# Altium project LAN7800_USB_Ethernet_RevA.PrjPcb
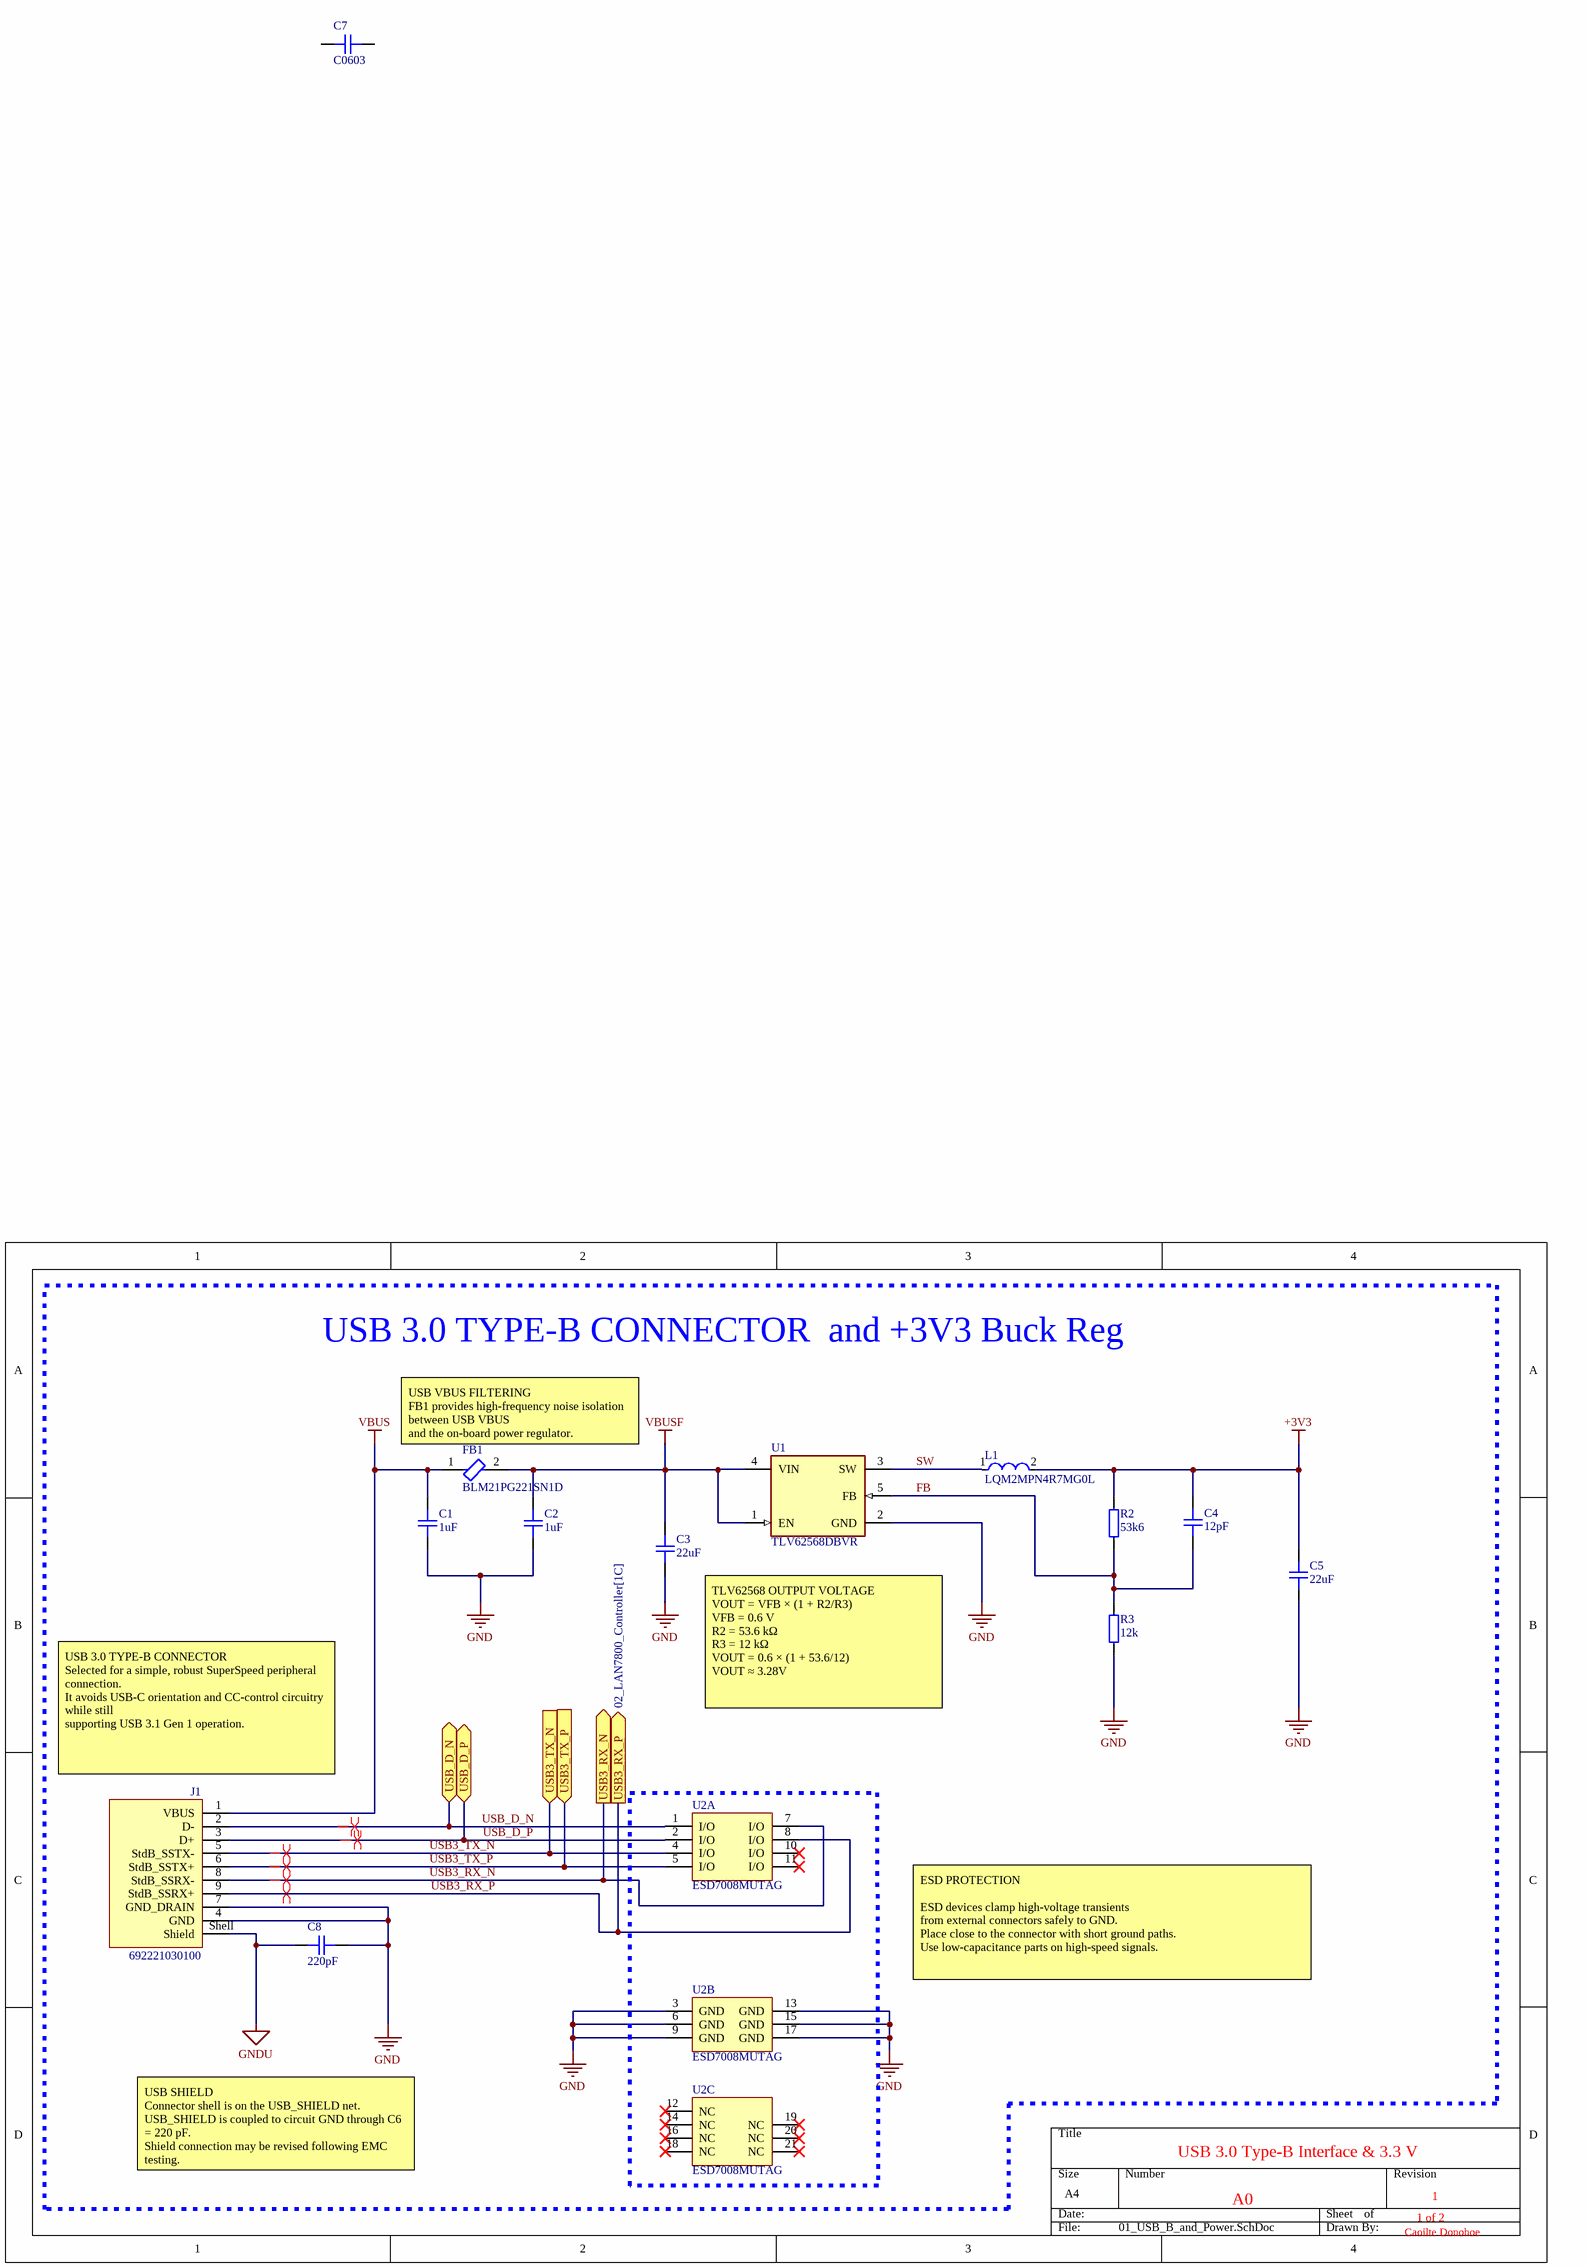
[diagram p0: 01_USB_B_and_Power.SchDoc]
2 sheets, 48 parts. Net scope: flat (ports and power ports of the same name join across sheets).
Board file: LAN7800_USB_Ethernet_RevA.PcbDoc
Sheets:
  01_USB_B_and_Power.SchDoc
  02_LAN7800_Controller.SchDoc

## Sheet 01_USB_B_and_Power.SchDoc: USB 3.0 Type-B Interface & 3.3 V Power
size A4; DrawnBy: Caoilte Donohoe; Revision: A0; SheetNumber: 1; SheetTotal: 4; Project Name: USB3 Gigabit Ethernet Adapter

### Parts
C1  1uF  [CAP_0402]
C2  1uF  [CAP_0402]
C3  22uF  [CAP_0805]
C4  12pF  [CAP_0402]
C5  22uF  [CAP_0805]
C6  22pF  [CAP_0603]
C7  C0603  [CAP_0603]
C8  220pF  [CAP_0603]
FB1  BLM21PG221SN1D  [FP-BLM21-0_2-t0_85-e0_5-IPC_C]
J1  692221030100  [692221030100]
L1  LQM2MPN4R7MG0L  [FP-LQM2MPN_G0-IPC_B]
R2  53k6  [RES_0402]
R3  12k  [RES_0402]
U1  TLV62568DBVR  [FP-DBV0005A-MFG]
U2  ESD7008MUTAG  [ONSC-UDFN-18-517BV_V]  (parts A,B,C of 3)

### Ports
USB3_RX_N (out, see 02_LAN7800_Controller[1C]), USB3_RX_P (out, see 02_LAN7800_Controller[1C]), USB3_TX_N (in), USB3_TX_P (in), USB_D_N (bidir, see 02_LAN7800_Controller[1C]), USB_D_P (bidir, see 02_LAN7800_Controller[1C])

### Nets
+3V3: C4.2 C5.2 L1.2 R2.2
GND: C1.1 C2.1 C3.1 C5.1 C8.2 J1.4(GND) J1.7(GND_DRAIN) R3.1 U1.2(GND) U2.3(GND) U2.6(GND) U2.9(GND) U2.13(GND) U2.15(GND) U2.17(GND)
GNDU: C8.1 J1.Shell(Shield)
VBUS: C1.2 FB1.1 J1.1(VBUS)
VBUSF: C2.2 C3.2 FB1.2 U1.1(EN) U1.4(VIN)
FB: C4.1 R2.1 R3.2 U1.5(FB)
SW: L1.1 U1.3(SW)
USB3_RX_N: J1.8(StdB_SSRX-) U2.7(I/O) ; port USB3_RX_N
USB3_RX_P: J1.9(StdB_SSRX+) U2.8(I/O) ; port USB3_RX_P
USB3_TX_N: J1.5(StdB_SSTX-) U2.4(I/O) ; port USB3_TX_N
USB3_TX_P: J1.6(StdB_SSTX+) U2.5(I/O) ; port USB3_TX_P
USB_D_N: J1.2(D-) U2.1(I/O) ; port USB_D_N
USB_D_P: J1.3(D+) U2.2(I/O) ; port USB_D_P

Not connected (* = marked no-connect by the designer): C6 1 2; C7 1 2; U2 10(I/O)* 11(I/O)* 12(NC)* 14(NC)* 16(NC)* 18(NC)* 19(NC)* 20(NC)* 21(NC)*

### Layout directives
differential pair: USB3_RX_N, USB3_RX_P, USB3_TX_N, USB3_TX_P, USB_D_N, USB_D_P

### Notes on the sheet
- USB 3.0 TYPE-B CONNECTOR  and +3V3 Buck Reg
- (near FB1) USB VBUS FILTERING
  FB1 provides high-frequency noise isolation between USB VBUS
  and the on-board power regulator.
- TLV62568 OUTPUT VOLTAGE
  VOUT = VFB × (1 + R2/R3)
  VFB = 0.6 V
  R2 = 53.6 kΩ
  R3 = 12 kΩ
  VOUT = 0.6 × (1 + 53.6/12)
  VOUT ≈ 3.28V
- (near J1) USB 3.0 TYPE-B CONNECTOR
  Selected for a simple, robust SuperSpeed peripheral connection.
  It avoids USB-C orientation and CC-control circuitry while still
  supporting USB 3.1 Gen 1 operation.
- ESD PROTECTION
  ESD devices clamp high-voltage transients
  from external connectors safely to GND.
  Place close to the connector with short ground paths.
  Use low-capacitance parts on high-speed signals.
- USB 3.0 Type-B Interface & 3.3 V Power
- USB SHIELD
  Connector shell is on the USB_SHIELD net.
  USB_SHIELD is coupled to circuit GND through C6 = 220 pF.
  Shield connection may be revised following EMC testing.
- A0
- 1 of 2
- 1
- Caoilte Donohoe

### Library data of the parts
C1 C2 C4 = CAP_0402: Capacitor SMD 0402; Manufacturer: *; Manufacturer Part Number: *; Distributor Link: *; LCSC: *; Rating: *; Dielectric: *
C3 C5 = CAP_0805: Capacitor SMD 0805; Manufacturer: *; Manufacturer Part Number: *; Distributor Link: *; LCSC: *; Rating: *; Dielectric: *
C6-C8 = CAP_0603: Capacitor SMD 0603; Manufacturer: *; Manufacturer Part Number: *; Distributor Link: *; LCSC: *; Rating: *; Dielectric: *
FB1 = CMP-0686-00610-3: Chip Ferrite Bead, 0805, 220Ω @ 100MHz, 0.045Ω, 25%, 2A; Number of Circuits: 1; Shielding: Unshielded; DC Resistance (DCR): 45mR; Impedance: 220R; Radiation Hardening: No; Material: Ferrite; Frequency: 100MHz; Width: 1.25mm; DC Current: 2A; Max DC Current: 2A; Number of Lines: 1; Package Quantity: 1; Case Code (Metric): 2012; Current Rating: 2A; Case/Package: 0805; Current: 2A; Military Standard: Not; Core Material: Ferrite; Depth: 1.25mm; Contact Plating: Tin; DC Resistance-Max: 45mR; Max Operating Temperature: 125°C; Length: 2mm; Max Current Rating: 2A; REACH SVHC: No SVHC; Termination: SMD/SMT; Min Operating Temperature: -55°C; Series: BLM21P; Test Frequency: 100MHz; Tolerance: 25%; Number of Pins: 2; RoHS Compliant: Yes; Height: 0.85mm; Packaging: Tape and Reel; Lead Free: Lead Free; Case Code (Imperial): 0805
J1 = CMP-1502-03224-3: Conn USB 3.0 Type B RCP 9 POS (1.75mm/2.5)mm/1.25mm Solder RA Thru-Hole 9 Terminal 1 Port Tray; Gender: Receptacle; USB Standard: USB 3.0; Insulation Resistance: 100MΩ; Voltage Rating: 30V; Current Rating: 250mA; Number of Contacts: 9; Contact Resistance: 50mΩ; Number of Ports: 1; Max Operating Temperature: 85°C; Contact Plating: Gold; Termination: Through Hole; Orientation: Horizontal; Contact Material: Nickel, Tin; RoHS: Compliant; Min Operating Temperature: -20°C; Flammability Rating: UL94 V-0; Connector Type: USB; Height: 13.05mm; Features: Shielded; Number of Pins: 9; Operating Supply Voltage: 30V; Mount: Horizontal, PCB, Through Hole; Lead Free: Lead Free; Voltage Rating (AC): 30V; Length: 12mm; Width: 18.3mm; Color: Blue
L1 = CMP-06042-016483-1: Multilayer Type Inductor for Power Lines, 0806 (2016), 4.7μH, 20%, 0.175Ω, 1.1A; Self Resonant Frequency: 20MHz; DC Resistance (DCR): 175mR; Test Frequency: 1MHz; Core Material: Ferrite; Shielding: Shielded; Inductance: 4.7uH; Max DC Current: 1.1A; Case Code (Metric): 2016; Min Operating Temperature: -55°C; Military Standard: Not; Depth: 1.75mm; RoHS Compliant: Yes; Packaging: Tape and Reel; Termination: SMD/SMT; Max Operating Temperature: 125°C; Case Code (Imperial): 0806; Width: 0.049inch; Package Quantity: 3000; Length: 0.079inch; DC Current: 1.1A; Mount: Surface Mount; Current Rating: 1.1A; Height - Seated (Max): 0.039inch; Case/Package: 0805; Weight: 0.000353oz; Height: 0.9mm; Tolerance: 20%
R2 R3 = RES_0402: Resistor SMD 0402; Manufacturer: *; Manufacturer Part Number: *; Distributor Link: *; LCSC: *
U1 = CMP-04918-000009-1: IC REG BUCK ADJ 1A SOT23-5; Manufacturer: Texas Instruments; Number Of Outputs: 1; Max Supply Voltage: 5.5V; Nominal Supply Current: 35uA; Standoff Height: 0mm; Max Junction Temp: +125°C; Output Voltage: 0.6-5.5V; Max Duty Cycle: 100%; Output Type: AdjustableProgrammable; Min Supply Voltage: 2.5V; Switching Frequency: 1.5MHz; Height: 1.45mm; Mouser Description: 1-A High Efficiency Synchronous Buck Converter, SMD, 5-pin SOT-23, T/R 3k; Temperature Range High: +125°C; Manufacturer Part Number: TLV62568DBVR; Switching Topology: Buck; ComponentLink2Description: Datasheet; Digikey Description: IC REG BUCK ADJ 1A SOT23-5; Octopart: https://octopart.com/tlv62568dbvr-texas+instruments-76926199; Category: IC; Device Class L1: Integrated Circuits (ICs); RoHS: TRUE; ComponentLink2URL: http://www.ti.com/lit/ds/symlink/tlv62568.pdf; Lead Free: Yes; Package: DBV0005A; Automotive: No; Device Class L2: Power Management ICs; Temperature: -40°C to +125°C; Temperature Range Low: -40°C; Device Class L3: Voltage Regulators - Switching; Output Current: 1A
U2 = CMP-1063-00247-1: Transient Voltage Suppressor, Low Capacitance ESD Protection for High Speed Data, 18-Pin UDFN, Pb-Free, Tape and Reel; Manufacturer: On Semiconductor; VRWM Max (V): 5; V(BR) Min (V): 5.5; Direction: Bidirectional; Number of Lines: 8; IR Max (uA): 1; ComponentLink1Description: Manufacturer URL; PackageReference: UDFN-18-517BV; PackageDescription: 18-Pin Small Outline No-Lead, Body 5.5 x 1.5 mm; PartNumber: ESD7008MUTAG; ComponentLink3URL: http://www.onsemi.cn/pub_link/Collateral/517BV.PDF; PackageVersion: Rev. A, 12/2012; ComponentLink2URL: http://www.onsemi.cn/pub_link/Collateral/ESD7008-D.PDF; DatasheetVersion: Rev. 4; ComponentLink2Description: Datasheet; RoHS: Pb-Free; Packing: Tape and Reel; Mounting Technology: Surface Mount; ComponentLink1URL: http://www.onsemi.com/; ComponentLink3Description: Package Specification

## Sheet 02_LAN7800_Controller.SchDoc
size A4; SheetNumber: 2; SheetTotal: 2
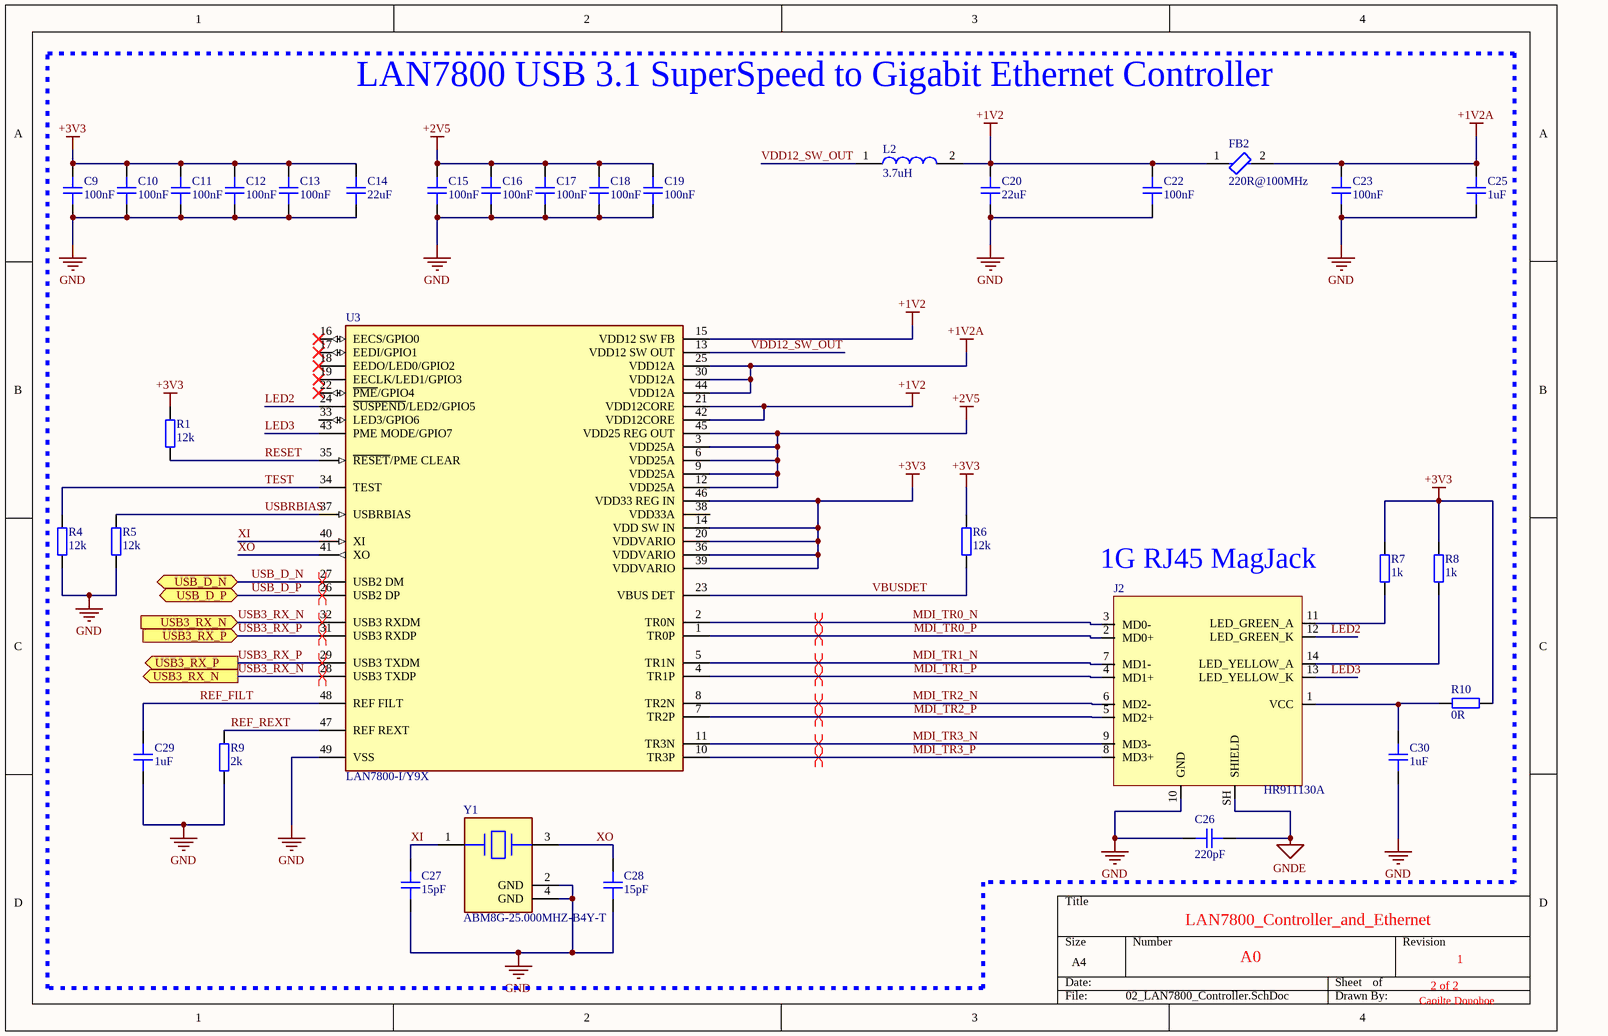
[diagram p1: 02_LAN7800_Controller.SchDoc]

### Parts
C9  100nF  [CAP_0402]
C10  100nF  [CAP_0402]
C11  100nF  [CAP_0402]
C12  100nF  [CAP_0402]
C13  100nF  [CAP_0402]
C14  22uF  [CAP_0603]
C15  100nF  [CAP_0402]
C16  100nF  [CAP_0402]
C17  100nF  [CAP_0402]
C18  100nF  [CAP_0402]
C19  100nF  [CAP_0402]
C20  22uF  [CAP_0603]
C22  100nF  [CAP_0402]
C23  100nF  [CAP_0402]
C25  1uF  [CAP_0402]
C26  220pF  [CAP_0603]
C27  15pF  [CAP_0603]
C28  15pF  [CAP_0603]
C29  1uF  [CAP_0402]
C30  1uF  [CAP_0402]
FB2  220R@100MHz  [FP-BLM21-0_2-t0_85-e0_5-IPC_C]
J2  HR911130A  [HR911130A]
L2  3.7uH  [LQM18PH1R0MFRB]
R1  12k  [RES_0402]
R4  12k  [RES_0402]
R5  12k  [RES_0402]
R6  12k  [RES_0402]
R7  1k  [RES_0402]
R8  1k  [RES_0402]
R9  2k  [RES_0402]
R10  0R  [RES_0402]
U3  LAN7800-I/Y9X  [FP-48SQFN-5304-7x7B-IPC_B]
Y1  ABM8G-25.000MHZ-B4Y-T  [FP-ABM8G-MFG]

### Ports
USB3_RX_N (in, see 01_USB_B_and_Power[2C], 02_LAN7800_Controller[1C]), USB3_RX_N (out, see 01_USB_B_and_Power[2C], 02_LAN7800_Controller[1C]), USB3_RX_P (in, see 01_USB_B_and_Power[2C], 02_LAN7800_Controller[1C]), USB3_RX_P (out, see 01_USB_B_and_Power[2C], 02_LAN7800_Controller[1C]), USB_D_N (bidir, see 01_USB_B_and_Power[2C]), USB_D_P (bidir, see 01_USB_B_and_Power[2C])

### Nets
+1V2: C20.2 C22.2 FB2.1 L2.2 U3.15(VDD12_SW_FB) U3.21(VDD12CORE) U3.42(VDD12CORE)
+1V2A: C23.2 C25.2 FB2.2 U3.25(VDD12A) U3.30(VDD12A) U3.44(VDD12A)
+2V5: C15.2 C16.2 C17.2 C18.2 C19.2 U3.3(VDD25A) U3.6(VDD25A) U3.9(VDD25A) U3.12(VDD25A) U3.45(VDD25_REG_OUT)
+3V3: C9.2 C10.2 C11.2 C12.2 C13.2 C14.2 R1.2 R6.1 R7.1 R8.1 R10.2 U3.14(VDD_SW_IN) U3.20(VDDVARIO) U3.36(VDDVARIO) U3.39(VDDVARIO) U3.46(VDD33_REG_IN)
GND: C9.1 C10.1 C11.1 C12.1 C13.1 C14.1 C15.1 C16.1 C17.1 C18.1 C19.1 C20.1 C22.1 C23.1 C25.1 C26.1 C27.1 C28.1 C29.1 C30.1 J2.10(GND) R4.1 R5.1 R9.1 U3.49(VSS) Y1.2(GND) Y1.4(GND)
GNDE: C26.2 J2.SH(SHIELD)
LED2: J2.12(LED_GREEN_K) U3.24(~{SUSPEND}/LED2/GPIO5)
LED3: J2.13(LED_YELLOW_K) U3.43(PME_MODE/GPIO7)
MDI_TR0_N: J2.3(MD0-) U3.2(TR0N)
MDI_TR0_P: J2.2(MD0+) U3.1(TR0P)
MDI_TR1_N: J2.7(MD1-) U3.5(TR1N)
MDI_TR1_P: J2.4(MD1+) U3.4(TR1P)
MDI_TR2_N: J2.6(MD2-) U3.8(TR2N)
MDI_TR2_P: J2.5(MD2+) U3.7(TR2P)
MDI_TR3_N: J2.9(MD3-) U3.11(TR3N)
MDI_TR3_P: J2.8(MD3+) U3.10(TR3P)
REF_FILT: C29.2 U3.48(REF_FILT)
REF_REXT: R9.2 U3.47(REF_REXT)
RESET: R1.1 U3.35(~{RESET}/PME_CLEAR)
TEST: R4.2 U3.34(TEST)
USB3_RX_N: U3.28(USB3_TXDP) U3.32(USB3_RXDM) ; port USB3_RX_N
USB3_RX_P: U3.29(USB3_TXDM) U3.31(USB3_RXDP) ; port USB3_RX_P
USB_D_N: U3.27(USB2_DM) ; port USB_D_N
USB_D_P: U3.26(USB2_DP) ; port USB_D_P
USBRBIAS: R5.2 U3.37(USBRBIAS)
VBUSDET: R6.2 U3.23(VBUS_DET)
VDD12_SW_OUT: L2.1 U3.13(VDD12_SW_OUT)
XI: C27.2 U3.40(XI) Y1.1
XO: C28.2 U3.41(XO) Y1.3
NetC30_2: C30.2 J2.1(VCC) R10.1
NetJ2_11: J2.11(LED_GREEN_A) R7.2
NetJ2_14: J2.14(LED_YELLOW_A) R8.2

Not connected (* = marked no-connect by the designer): U3 16(EECS/GPIO0)* 17(EEDI/GPIO1)* 18(EEDO/LED0/GPIO2)* 19(EECLK/LED1/GPIO3)* 22(~{PME}/GPIO4)* 33(LED3/GPIO6) 38(VDD33A)

### Layout directives
differential pair: MDI_TR0_N, MDI_TR0_P, MDI_TR1_N, MDI_TR1_P, MDI_TR2_N, MDI_TR2_P, MDI_TR3_N, MDI_TR3_P, USB3_RX_N, USB3_RX_P, USB_D_N, USB_D_P

### Notes on the sheet
- LAN7800 USB 3.1 SuperSpeed to Gigabit Ethernet Controller
- 1G RJ45 MagJack
- LAN7800_Controller_and_Ethernet
- A0
- 2 of 2
- 1
- Caoilte Donohoe

### Library data of the parts
C9-C13 C15-C19 C22 C23 C25 C29 C30 = CAP_0402: Capacitor SMD 0402; Manufacturer: *; Manufacturer Part Number: *; Distributor Link: *; LCSC: *; Rating: *; Dielectric: *
C14 C20 C26-C28 = CAP_0603: Capacitor SMD 0603; Manufacturer: *; Manufacturer Part Number: *; Distributor Link: *; LCSC: *; Rating: *; Dielectric: *
FB2 = CMP-0686-00610-3: as FB1 on sheet 01_USB_B_and_Power; Radiation Hardening: No; Material: Ferrite; Frequency: 100MHz; Width: 1.25mm; DC Current: 2A; Max DC Current: 2A; Number of Lines: 1; Package Quantity: 1; Case Code (Metric): 2012; Current Rating: 2A; Case/Package: 0805; Current: 2A; Military Standard: Not; Core Material: Ferrite; Depth: 1.25mm; Contact Plating: Tin; DC Resistance-Max: 45mR; Max Operating Temperature: 125°C; Length: 2mm; Max Current Rating: 2A; REACH SVHC: No SVHC; Termination: SMD/SMT; Min Operating Temperature: -55°C; Series: BLM21P; Test Frequency: 100MHz; Tolerance: 25%; Number of Pins: 2; RoHS Compliant: Yes; Height: 0.85mm; Packaging: Tape and Reel; Lead Free: Lead Free; Case Code (Imperial): 0805
J2 = HR911130A: 100/1000Base-T Magnetics Single-Port RJ45 Connector with Integrated Magnetics and LEDs; Manufacturer: Hanrun; Manufacturer Part Number: HR911130A
L2 = LQM18PN3R3MFRL: Inductor; Manufacturer_Name: Murata Electronics; Datasheet Link: https://search.murata.co.jp/Ceramy/image/img/P02/JELF243B-0033.pdf; Height: 0.95mm; Manufacturer_Part_Number: LQM18PN3R3MFRL; Mouser Part Number: 81-LQM18PN3R3MFRL; Mouser Price/Stock: https://www.mouser.co.uk/ProductDetail/Murata-Electronics/LQM18PN3R3MFRL?qs=Gufeu08L%2Fl3lDzOKkPPhgg%3D%3D; Arrow Part Number: LQM18PN3R3MFRL; Arrow Price/Stock: https://www.arrow.com/en/products/lqm18pn3r3mfrl/murata-manufacturing
R1 R4-R10 = RES_0402: Resistor SMD 0402; Manufacturer: *; Manufacturer Part Number: *; Distributor Link: *; LCSC: *
U3 = CMP-06298-000014-1: IC ETHERNET CTLR USB 48SQFN; Operating Supply Current: 4mA; Min Operating Temperature: -40°C; Max Operating Temperature: 85°C; Packaging: Tray
Y1 = CMP-27762-000021-2: Crystal 25MHz ±30ppm (Tol) ±30ppm (Stability) 10pF FUND 60Ω 4-Pin SMD T/R; ESR (Equivalent Series Resistance): 60R; Depth: 2.5mm; Frequency Stability: 30ppm; Mount: Surface Mount; Lead Free: Lead Free; Max Operating Temperature: 70°C; Series: ABM8G; Frequency Tolerance: 30ppm; Min Operating Temperature: -20°C; Number of Pins: 4; Operating Frequency: 25 MHz; Termination: SMD/SMT; Frequency: 25MHz; Case/Package: CSMD; Packaging: Tape and Reel; Package Quantity: 1000; Tolerance: 30ppm; Length: 3.2mm; Height: 0.039inch; Load Capacitance: 10pF; Width: 0.098inch; Series Resistance: 60R

## Nets that join several sheets
+3V3: 01_USB_B_and_Power (C4.2 C5.2 L1.2 R2.2), 02_LAN7800_Controller (16 pins)
GND: 01_USB_B_and_Power (15 pins), 02_LAN7800_Controller (27 pins)
USB3_RX_N: 01_USB_B_and_Power (J1.8 U2.7), 02_LAN7800_Controller (U3.28 U3.32)
USB3_RX_P: 01_USB_B_and_Power (J1.9 U2.8), 02_LAN7800_Controller (U3.29 U3.31)
USB_D_N: 01_USB_B_and_Power (J1.2 U2.1), 02_LAN7800_Controller (U3.27)
USB_D_P: 01_USB_B_and_Power (J1.3 U2.2), 02_LAN7800_Controller (U3.26)